# EAGLE schematic VoiceBox (EAGLE 7.1.0)
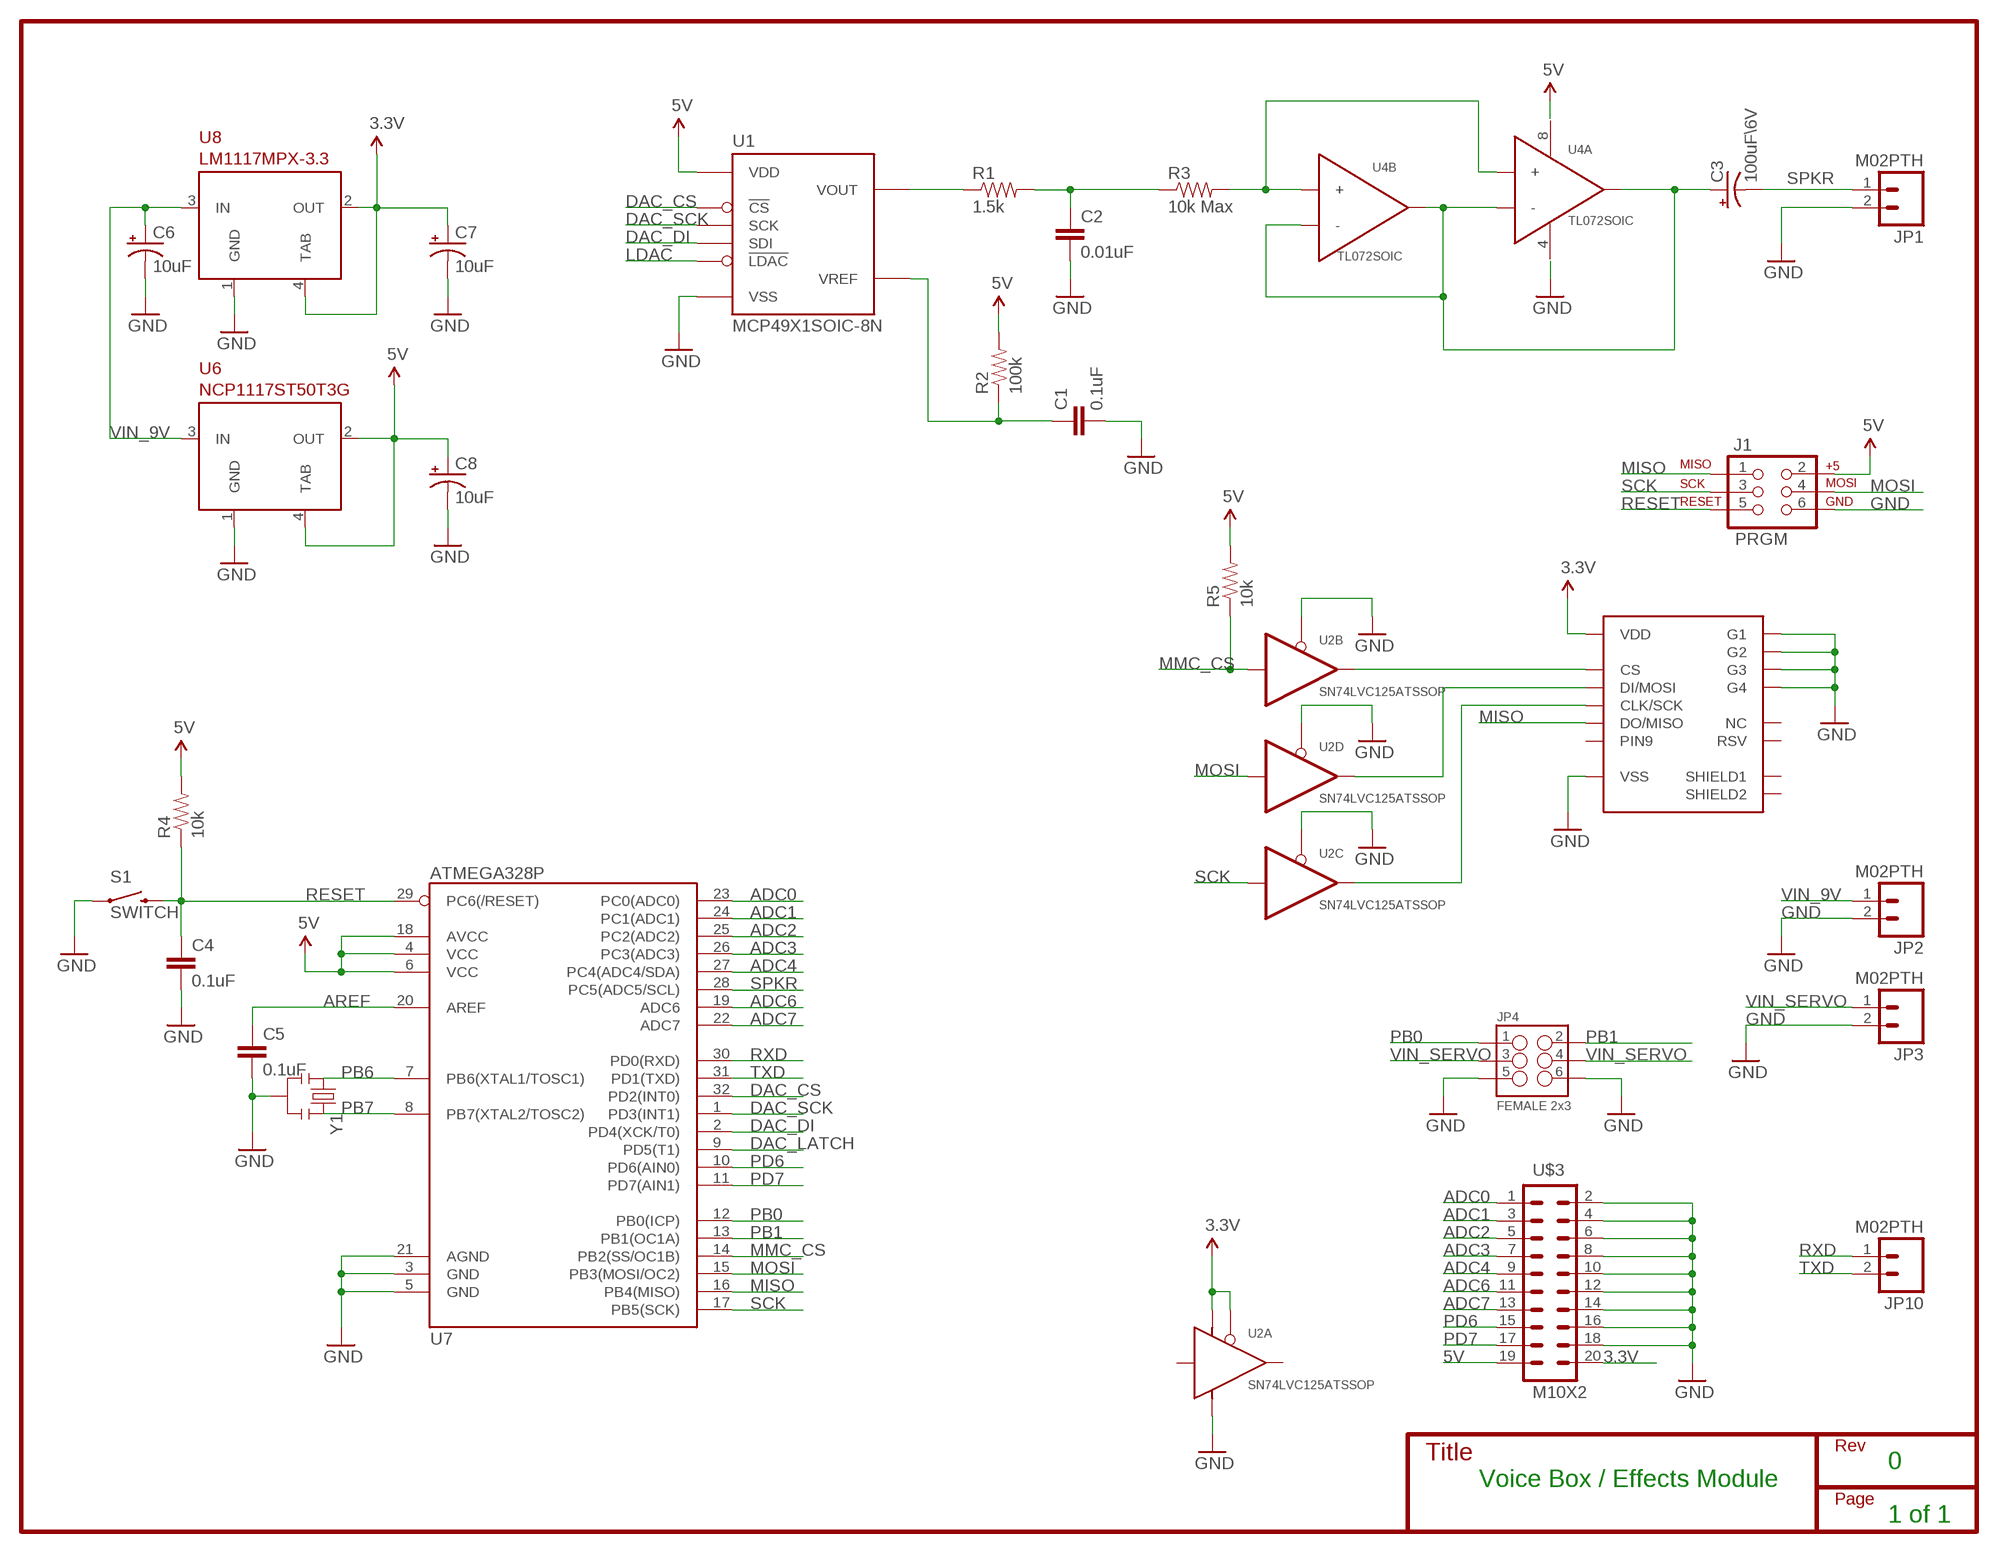
[diagram p0: schematic, sheet 1]

## Parts
C1  0.1uF  CAP0603-CAP  [0603-CAP]
C2  0.01uF  CAP0603-CAP  [0603-CAP]
C3  100uF\\6V  CAP_POL6032  [EIA6032]
C4  0.1uF  CAP0603-CAP  [0603-CAP]
C5  0.1uF  CAP0603-CAP  [0603-CAP]
C6  10uF  CAP_POL6032  [EIA6032]
C7  10uF  CAP_POL6032  [EIA6032]
C8  10uF  CAP_POL6032  [EIA6032]
J1  PRGM  AVR_SPI_PRG_6PTH  [2X3]
JP1  M02PTH  [1X02]
JP2  M02PTH  [1X02]
JP3  M02PTH  [1X02]
JP4  FEMALE 2x3  M03X2FEMALE  [2X3]
JP10  M02PTH  [1X02]
R1  1.5k  RESISTOR0603-RES  [0603-RES]
R2  100k  RESISTOR0603-RES  [0603-RES]
R3  10k Max  RESISTOR0603-RES  [0603-RES]
R4  10k  RESISTOR0603-RES  [0603-RES]
R5  10k  RESISTOR0603-RES  [0603-RES]
S1  SWITCH  SWITCH-MOMENTARY-2SMD  [TACTILE_SWITCH_SMD]
U1  MCP49X1SOIC-8N  [SO08]
U2  SN74LVC125ATSSOP  [14-TSSOP]
U3  MICROSD_SOCKET  [1932739]
U4  TL072SOIC  [SO08]
U6  NCP1117ST50T3G  [SOT223]
U7  ATMEGA328P  ATMEGA328_SMT  [TQFP32-08]
U8  LM1117MPX-3.3  [SOT223]
U$3  M10X2  [2X10]
Y1  RESONATORPTH  [RESONATOR-PTH]

## Nets
3.3V: C7.P$1(+) U2.1(A:!OE) U2.14(A:VCC) U3.4(VDD) U8.2(OUT) U8.4(TAB) U$3.20
5V: C8.P$1(+) J1.2 R2.2 R4.2 R5.2 U1.1(VDD) U6.2(OUT) U6.4(TAB) U7.4(VCC) U7.6(VCC) U7.18(AVCC) U$3.19
ADC0: U7.23(PC0(ADC0)) U$3.1
ADC1: U7.24(PC1(ADC1)) U$3.3
ADC2: U7.25(PC2(ADC2)) U$3.5
ADC3: U7.26(PC3(ADC3)) U$3.7
ADC4: U7.27(PC4(ADC4/SDA)) U$3.9
ADC6: U7.19(ADC6) U$3.11
ADC7: U7.22(ADC7) U$3.13
AREF: C5.1 U7.20(AREF)
DAC_CS: U1.2(!CS) U7.32(PD2(INT0))
DAC_DI: U1.4(SDI) U7.2(PD4(XCK/T0))
DAC_LATCH: U7.9(PD5(T1))
DAC_SCK: U1.3(SCK) U7.1(PD3(INT1))
GND: C1.2 C2.2 C4.2 C5.2 C6.P$2(-) C7.P$2(-) C8.P$2(-) J1.6 JP1.2 JP2.2 JP3.2 JP4.5 JP4.6 S1.1 U1.7(VSS) U2.4(B:!OE) U2.7(A:GND) U2.10(C:!OE) U2.13(D:!OE) U3.6(VSS) U3.G1 U3.G2 U3.G3 U3.G4 U6.1(GND) U7.3(GND) U7.5(GND) U7.21(AGND) U8.1(GND) U$3.2 U$3.4 U$3.6 U$3.8 U$3.10 U$3.12 U$3.14 U$3.16 U$3.18 Y1.2
LDAC: U1.5(!LDAC)
MISO: J1.1 U3.7(DO/MISO) U7.16(PB4(MISO))
MMC_CS: R5.1 U2.5(B:IN) U7.14(PB2(SS/OC1B))
MOSI: J1.4 U2.12(D:IN) U7.15(PB3(MOSI/OC2))
N$1: U2.6(B:OUT) U3.2(CS)
N$2: U2.11(D:OUT) U3.3(DI/MOSI)
N$3: U2.8(C:OUT) U3.5(CLK/SCK)
N$4: C1.1 R2.1 U1.6(VREF)
N$5: R1.1 U1.8(VOUT)
N$6: C2.1 R1.2 R3.1
N$7: R3.2 U4.3(A:+) U4.5(B:+)
N$8: C3.P$1(+) U4.1(A:OUT) U4.2(A:-) U4.6(B:-) U4.7(B:OUT)
PB0: JP4.1 U7.12(PB0(ICP))
PB1: JP4.2 U7.13(PB1(OC1A))
PB6: U7.7(PB6(XTAL1/TOSC1)) Y1.1
PB7: U7.8(PB7(XTAL2/TOSC2)) Y1.3
PD6: U7.10(PD6(AIN0)) U$3.15
PD7: U7.11(PD7(AIN1)) U$3.17
RESET: C4.1 J1.5 R4.1 S1.3 U7.29(PC6(/RESET))
RXD: JP10.1 U7.30(PD0(RXD))
SCK: J1.3 U2.9(C:IN) U7.17(PB5(SCK))
SPKR: C3.P$2(-) JP1.1 U7.28(PC5(ADC5/SCL))
TXD: JP10.2 U7.31(PD1(TXD))
VIN_9V: C6.P$1(+) JP2.1 U6.3(IN) U8.3(IN)
VIN_SERVO: JP3.1 JP4.3 JP4.4
Unconnected: U2.2(A:IN) U2.3(A:OUT) U3.1(NC) U3.8(RSV) U3.9(PIN9) U3.SHIELD1 U3.SHIELD2

## Notes on the sheet
- 0
- Voice Box / Effects Module
- 1 of 1

## Power pins joined to a net without a drawn wire
4: U4.4
8: U4.8

## Library data of the parts
C1 C2 C5 = SparkFun-Passives:CAP: Capacitor Standard 0603 ceramic capacitor, and 0.1" leaded capacitor.
C3 C6-C8 = SparkFun-Capacitors:CAP_POL: Capacitor Polarized These are standard SMD and PTH capacitors. Normally 10uF, 47uF, and 100uF in electrolytic and tantalum varieties. Always verify the external diameter of the through hole cap, it varies with capacity, voltage, and manufacturer. The EIA devices should be standard.
C4 = SparkFun-Capacitors:CAP: Capacitor Standard 0603 ceramic capacitor, and 0.1" leaded capacitor.
J1 = SparkFun-Connectors:AVR_SPI_PRG_6: AVR ISP 6 Pin This is the reduced ISP connector for AVR programming. Common on Arduino. This footprint will take up less PCB space and can be used with a 10-pin to 6-pin adapter such as SKU: BOB-08508
JP1-JP3 JP10 = SparkFun-Connectors:M02: Standard 2-pin 0.1" header. Use with - straight break away headers ( PRT-00116) - right angle break away headers (PRT-00553) - swiss pins (PRT-00743) - machine pins (PRT-00117) - female headers (PRT-00115) Molex polarized connector foot print use with: PRT-08233 with associated crimp pins and housings. 2.54_SCREWTERM for use with PRT-10571. 3.5mm Screw Terminal footprints for PRT-08084 5mm Screw Terminal footprints for use with PRT-08432
JP4 = SparkFun-Connectors:M03X2: 2x3 .1" header. Shrouded, with keying- CONN-10681 SMT- CONN-11415 Pogo pins- HW-11044; PROD_ID: CONN-11566
R1-R5 = SparkFun-Passives:RESISTOR: Resistor Basic schematic elements and footprints for 0603, 1206, and PTH resistors.
S1 = SparkFun-Electromechanical:SWITCH-MOMENTARY-2: Various NO switches- pushbuttons, reed, etc; PROD_ID: SWCH-08247
U1 = DigitalICs:MCP49X1: MCP49x1 8-bit, 10-bit or 12-bit DAC
U2 = LogicICs:SN74LVC125A: SN74LVC125A Quad Tri-State Buffer
U3 = Connectors:MICROSD_SOCKET: Micro SD Card Push/Pull Card Socket; DIGIKEYPART#: A118085CT-ND
U4 = AnalogICs:TL072: TL072 Dual Low-Noise JFET-Input Op Amp
U6 = regulators:NCP1117ST50T3G: NCP1117 5V, 1.0 A Low-Dropout Positive Fixed and Adjustable Voltage Regulator Datasheet <http://www.onsemi.com/pub_link/Collateral/NCP1117-D.PDF>; DIGIKEYPART#: NCP1117ST50T3GOSCT-ND
U7 = SparkFun-DigitalIC:ATMEGA328_SMT: 32-Pin Atmega328 part Commonly used on Arduino compatible boards Available in QFP and QFN packages TQFP is IC-09069 QFN is non-stock; PROD_ID: IC-09069
U8 = regulators:LM1117MPX-3.3: 3.3V Low Dropout Regulator, 0.8A output. See datasheet for more info Datasheet <http://www.ti.com/lit/ds/symlink/lm1117-n.pdf>; DIGIKEYPART#: LM1117MPX-3.3/NOPBCT-ND
U$3 = SparkFun-Connectors:M10X2: This was SPECIALLY designed to be used with our Graphic LCD Backpack. Be sure you want to use this! It is not only staggered on each line of header holes, but IT IS ALSO offset of the center point of the top and bottom lines by 5 mil. This causes the headers to lock into place on the "standard" footprint on the LCD screen. The extra squares on the tdocu layer are there simply to reference other pins (if you were to actually populate a longer header than ten long - this is what we do with the backpacks).
Y1 = SparkFun-FreqCtrl:RESONATOR: Resonator Small SMD resonator. Used, eg, on the Arduino Pro/ Pro Mini boards. 8MHz- XTAL-08895 16MHz- XTAL-08900